# Altium schematic sheet Mantra2017 Project.SchDoc: Mantra 2017
size A4; Author: MikrySoft; DocumentNumber: 1; Revision: 1; SheetNumber: 1; SheetTotal: 10
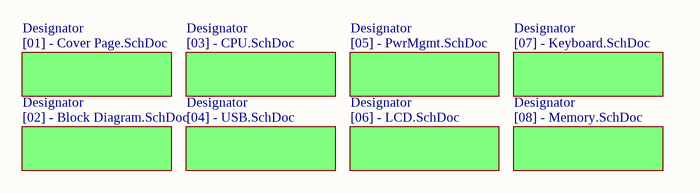
[diagram p0: Mantra2017 Project.SchDoc]

## Sub-sheets
Designator = [01] - Cover Page.SchDoc: no entries
Designator = [02] - Block Diagram.SchDoc: no entries
Designator = [03] - CPU.SchDoc: no entries
Designator = [04] - USB.SchDoc: no entries
Designator = [05] - PwrMgmt.SchDoc: no entries
Designator = [06] - LCD.SchDoc: no entries
Designator = [07] - Keyboard.SchDoc: no entries
Designator = [08] - Memory.SchDoc: no entries

## Notes on the sheet
- Title
- Size:
- Date:
- A4
- Number:
- Time:
- Revision:
- Sheet
- of
- File: